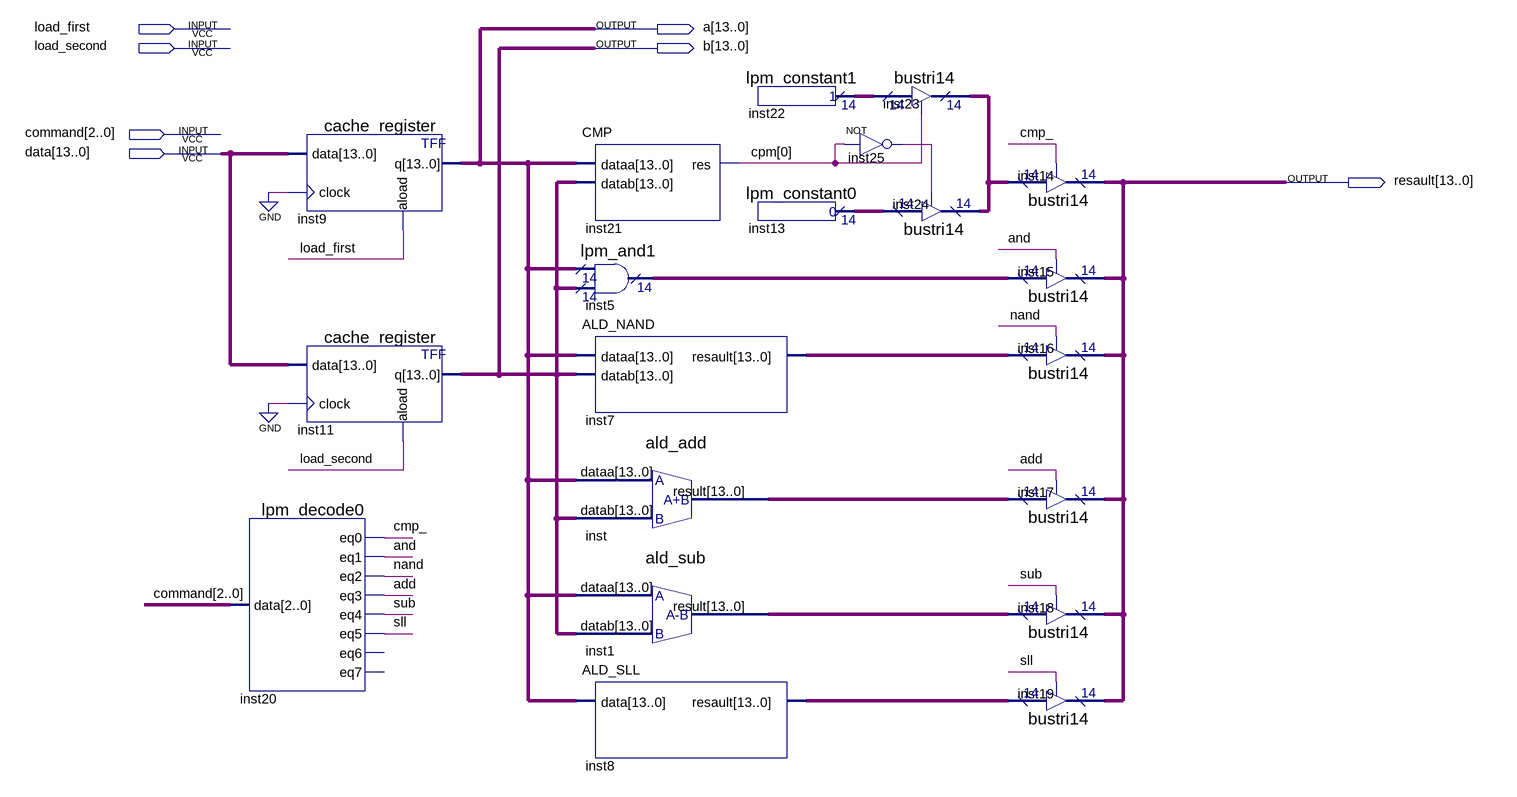
[diagram p0: schematic sheet]
// Quartus schematic ALD.bdf as structural Verilog: 20 symbols, 7 pins
module ALD (
  input  load_first,
  input  load_second,
  input  [2:0] command,
  input  [13:0] data,
  output [13:0] a,
  output [13:0] b,
  output [13:0] resault
);

  wire add, \and , cmp_, inst25_out, \nand , sll, sub;
  wire [0:0] cpm;
  wire [13:0] inst1_result, inst5_result, inst7_resault, inst8_resault, inst13_result, inst22_result,
       inst23_tridata, inst_result;

  lpm_decode0 inst20 (
    .data(command), .eq0(cmp_), .eq1(\and ), .eq2(\nand ), .eq3(add), .eq4(sub), .eq5(sll));  // open: eq6, eq7
  cache_register inst9 (.data(data), .clock(1'b0), .aload(load_first), .q(a));
  cache_register inst11 (.data(data), .clock(1'b0), .aload(load_second), .q(b));
  CMP inst21 (.dataa(a), .datab(b), .res(cpm[0]));
  lpm_and1 inst5 (.data0x(a), .data1x(b), .result(inst5_result));
  ALD_NAND inst7 (.dataa(a), .datab(b), .resault(inst7_resault));
  ald_add inst (.dataa(a), .datab(b), .result(inst_result));
  ald_sub inst1 (.dataa(a), .datab(b), .result(inst1_result));
  ALD_SLL inst8 (.data(a), .resault(inst8_resault));
  lpm_constant1 inst22 (.result(inst22_result));
  lpm_constant0 inst13 (.result(inst13_result));
  not inst25 (inst25_out, cpm[0]);
  bustri14 inst23 (.enabledt(cpm[0]), .data(inst22_result), .tridata(inst23_tridata));
  bustri14 inst24 (.enabledt(inst25_out), .data(inst13_result), .tridata(inst23_tridata));
  bustri14 inst14 (.enabledt(cmp_), .data(inst23_tridata), .tridata(resault));
  bustri14 inst15 (.enabledt(\and ), .data(inst5_result), .tridata(resault));
  bustri14 inst16 (.enabledt(\nand ), .data(inst7_resault), .tridata(resault));
  bustri14 inst17 (.enabledt(add), .data(inst_result), .tridata(resault));
  bustri14 inst18 (.enabledt(sub), .data(inst1_result), .tridata(resault));
  bustri14 inst19 (.enabledt(sll), .data(inst8_resault), .tridata(resault));
endmodule
